# Altium schematic sheet ADC.SchDoc
size 420 x 297 mm; Author: Nguyễn Huy Hoàng; SheetNumber: 3; SheetTotal: 5; Instructor: Nguyễn Trung Hiếu
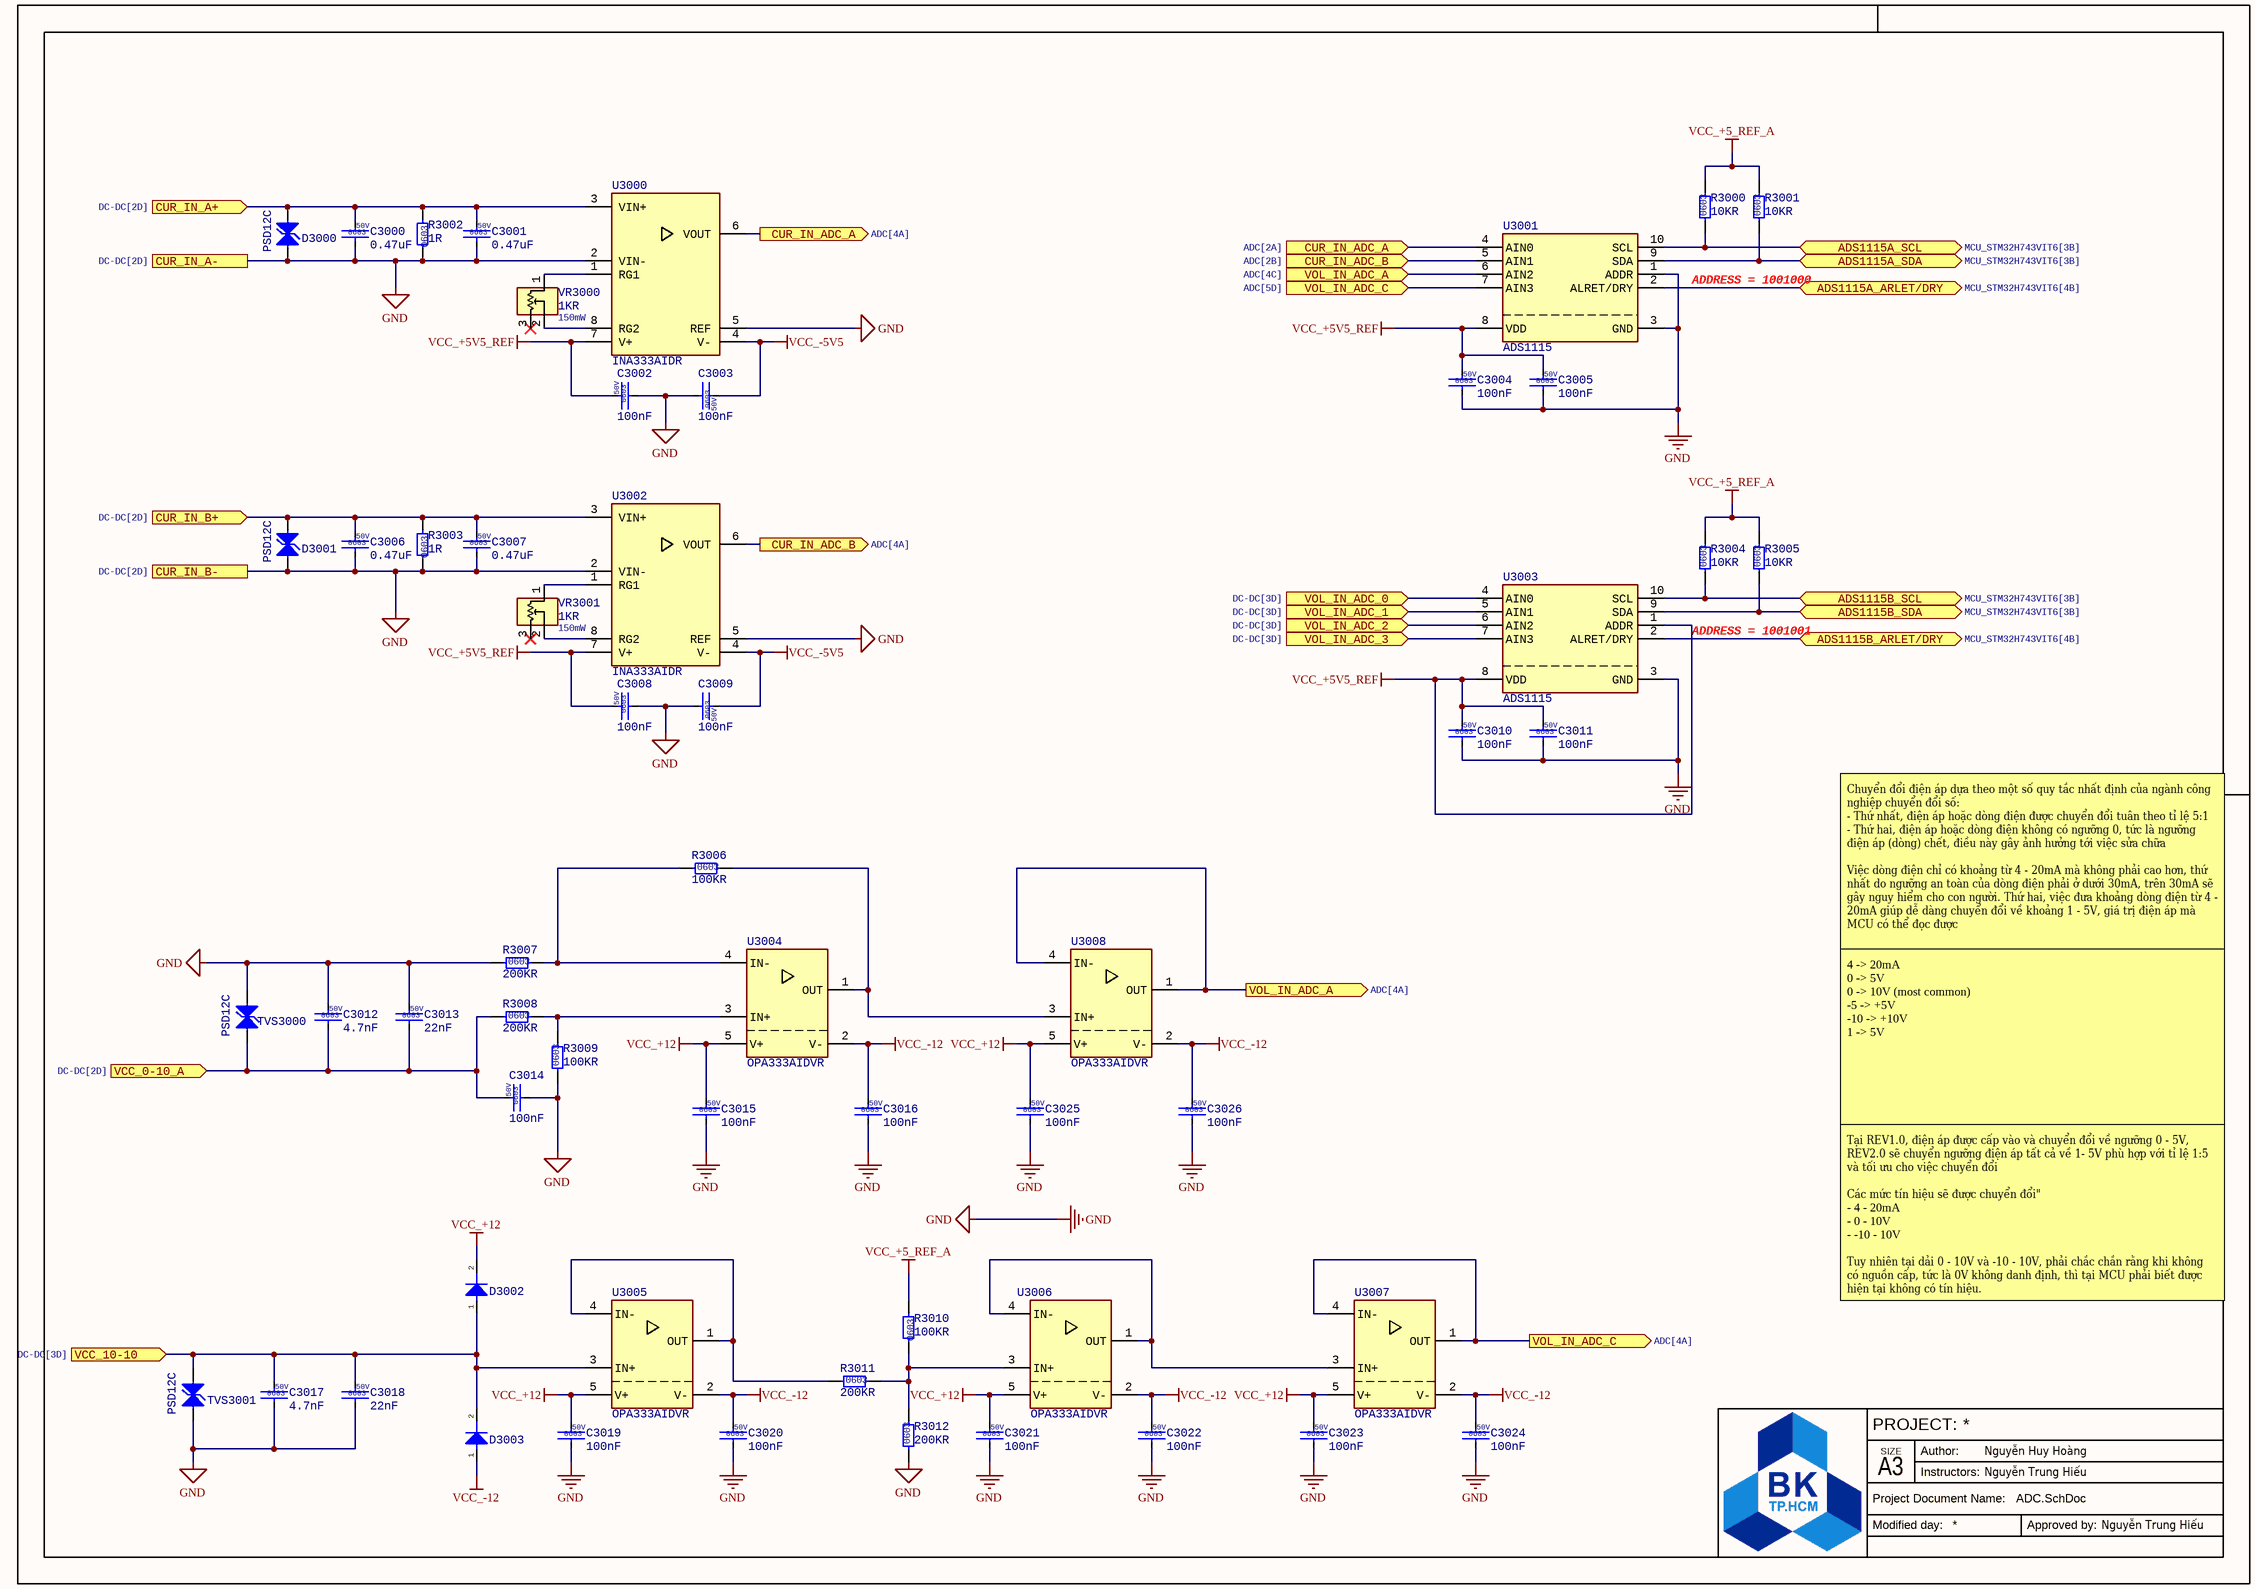
[diagram p0: ADC.SchDoc]

## Parts
C3000  0.47uF  Voltage: 50V  Size: 0603  [CAP CER 0603]
C3001  0.47uF  Voltage: 50V  Size: 0603  [CAP CER 0603]
C3002  100nF  Voltage: 50V  Size: 0603  [CAP CER 0603]
C3003  100nF  Voltage: 50V  Size: 0603  [CAP CER 0603]
C3004  100nF  Voltage: 50V  Size: 0603  [CAP CER 0603]
C3005  100nF  Voltage: 50V  Size: 0603  [CAP CER 0603]
C3006  0.47uF  Voltage: 50V  Size: 0603  [CAP CER 0603]
C3007  0.47uF  Voltage: 50V  Size: 0603  [CAP CER 0603]
C3008  100nF  Voltage: 50V  Size: 0603  [CAP CER 0603]
C3009  100nF  Voltage: 50V  Size: 0603  [CAP CER 0603]
C3010  100nF  Voltage: 50V  Size: 0603  [CAP CER 0603]
C3011  100nF  Voltage: 50V  Size: 0603  [CAP CER 0603]
C3012  4.7nF  Voltage: 50V  Size: 0603  [CAP CER 0603]
C3013  22nF  Voltage: 50V  Size: 0603  [CAP CER 0603]
C3014  100nF  Voltage: 50V  Size: 0603  [CAP CER 0603]
C3015  100nF  Voltage: 50V  Size: 0603  [CAP CER 0603]
C3016  100nF  Voltage: 50V  Size: 0603  [CAP CER 0603]
C3017  4.7nF  Voltage: 50V  Size: 0603  [CAP CER 0603]
C3018  22nF  Voltage: 50V  Size: 0603  [CAP CER 0603]
C3019  100nF  Voltage: 50V  Size: 0603  [CAP CER 0603]
C3020  100nF  Voltage: 50V  Size: 0603  [CAP CER 0603]
C3021  100nF  Voltage: 50V  Size: 0603  [CAP CER 0603]
C3022  100nF  Voltage: 50V  Size: 0603  [CAP CER 0603]
C3023  100nF  Voltage: 50V  Size: 0603  [CAP CER 0603]
C3024  100nF  Voltage: 50V  Size: 0603  [CAP CER 0603]
C3025  100nF  Voltage: 50V  Size: 0603  [CAP CER 0603]
C3026  100nF  Voltage: 50V  Size: 0603  [CAP CER 0603]
D3000  PSD12C  [SOD-323]
D3001  PSD12C  [SOD-323]
D3002  1N4148W-E3-18  [SOD-123]  (value not drawn)
D3003  1N4148W-E3-18  [SOD-123]  (value not drawn)
R3000  10KR  Size: 0603  [RESC 0603(1608) SMD]
R3001  10KR  Size: 0603  [RESC 0603(1608) SMD]
R3002  1R  Size: 0603  [RESC 0603(1608) SMD]
R3003  1R  Size: 0603  [RESC 0603(1608) SMD]
R3004  10KR  Size: 0603  [RESC 0603(1608) SMD]
R3005  10KR  Size: 0603  [RESC 0603(1608) SMD]
R3006  100KR  Size: 0603  [RESC 0603(1608) SMD]
R3007  200KR  Size: 0603  [RESC 0603(1608) SMD]
R3008  200KR  Size: 0603  [RESC 0603(1608) SMD]
R3009  100KR  Size: 0603  [RESC 0603(1608) SMD]
R3010  100KR  Size: 0603  [RESC 0603(1608) SMD]
R3011  200KR  Size: 0603  [RESC 0603(1608) SMD]
R3012  200KR  Size: 0603  [RESC 0603(1608) SMD]
TVS3000  PSD12C  [SOD-323]
TVS3001  PSD12C  [SOD-323]
U3000  INA333AIDR  [VSSOP-8]
U3001  ADS1115  [VSSOP-10]
U3002  INA333AIDR  [VSSOP-8]
U3003  ADS1115  [VSSOP-10]
U3004  OPA333AIDVR  [SOT23-5]
U3005  OPA333AIDVR  [SOT23-5]
U3006  OPA333AIDVR  [SOT23-5]
U3007  OPA333AIDVR  [SOT23-5]
U3008  OPA333AIDVR  [SOT23-5]
VR3000  1KR  Power Rate: 150mW  [VARIABLE RESISTOR]
VR3001  1KR  Power Rate: 150mW  [VARIABLE RESISTOR]

## Ports
ADS1115A_ARLET/DRY (bidir, see MCU_STM32H743VIT6[4B]), ADS1115A_SCL (bidir, see MCU_STM32H743VIT6[3B]), ADS1115A_SDA (bidir, see MCU_STM32H743VIT6[3B]), ADS1115B_ARLET/DRY (bidir, see MCU_STM32H743VIT6[4B]), ADS1115B_SCL (bidir, see MCU_STM32H743VIT6[3B]), ADS1115B_SDA (bidir, see MCU_STM32H743VIT6[3B]), CUR_IN_A+ (in, see DC-DC[2D]), CUR_IN_A- (see DC-DC[2D]), CUR_IN_ADC_A (in, see ADC[2A]), CUR_IN_ADC_A (out, see ADC[4A]), CUR_IN_ADC_B (in, see ADC[2B]), CUR_IN_ADC_B (out, see ADC[4A]), CUR_IN_B+ (in, see DC-DC[2D]), CUR_IN_B- (see DC-DC[2D]), VCC_0-10_A (in, see DC-DC[2D]), VCC_10-10 (in, see DC-DC[3D]), VOL_IN_ADC_0 (in, see DC-DC[3D]), VOL_IN_ADC_1 (in, see DC-DC[3D]), VOL_IN_ADC_2 (in, see DC-DC[3D]), VOL_IN_ADC_3 (in, see DC-DC[3D]), VOL_IN_ADC_A (in, see ADC[4C]), VOL_IN_ADC_A (out, see ADC[4A]), VOL_IN_ADC_C (in, see ADC[5D]), VOL_IN_ADC_C (out, see ADC[4A])

## Nets
GND: C3000.2 C3001.2 C3002.2 C3003.2 C3004.2 C3005.2 C3006.2 C3007.2 C3008.2 C3009.2 C3010.2 C3011.2 C3012.1 C3013.1 C3014.2 C3015.2 C3016.2 C3017.2 C3018.2 C3019.2 C3020.2 C3021.2 C3022.2 C3023.2 C3024.2 C3025.2 C3026.2 D3000.2 D3001.2 R3002.2 R3003.2 R3007.1 R3009.1 R3012.1 TVS3000.1 TVS3001.2 U3000.2(VIN-) U3000.5(REF) U3001.1(ADDR) U3001.3(GND) U3002.2(VIN-) U3002.5(REF) U3003.3(GND) ; port CUR_IN_A-, port CUR_IN_B-
VCC_+5_REF_A: R3000.2 R3001.2 R3004.2 R3005.2 R3010.1
VCC_+5V5_REF: C3002.1 C3004.1 C3005.1 C3008.1 C3010.1 C3011.1 U3000.7(V+) U3001.8(VDD) U3002.7(V+) U3003.1(ADDR) U3003.8(VDD)
VCC_+12: C3015.1 C3019.1 C3021.1 C3023.1 C3025.1 D3002.2(K) U3004.5(V+) U3005.5(V+) U3006.5(V+) U3007.5(V+) U3008.5(V+)
VCC_-5V5: C3003.1 C3009.1 U3000.4(V-) U3002.4(V-)
VCC_-12: C3016.1 C3020.1 C3022.1 C3024.1 C3026.1 D3003.1(A) U3004.2(V-) U3005.2(V-) U3006.2(V-) U3007.2(V-) U3008.2(V-)
ADS1115A_ARLET/DRY: U3001.2(ALRET/DRY) ; port ADS1115A_ARLET/DRY
ADS1115A_SCL: R3000.1 U3001.10(SCL) ; port ADS1115A_SCL
ADS1115A_SDA: R3001.1 U3001.9(SDA) ; port ADS1115A_SDA
ADS1115B_ARLET/DRY: U3003.2(ALRET/DRY) ; port ADS1115B_ARLET/DRY
ADS1115B_SCL: R3004.1 U3003.10(SCL) ; port ADS1115B_SCL
ADS1115B_SDA: R3005.1 U3003.9(SDA) ; port ADS1115B_SDA
CUR_IN_A+: C3000.1 C3001.1 D3000.1 R3002.1 U3000.3(VIN+) ; port CUR_IN_A+
CUR_IN_ADC_A: U3000.6(VOUT) U3001.4(AIN0) ; port CUR_IN_ADC_A
CUR_IN_ADC_B: U3001.5(AIN1) U3002.6(VOUT) ; port CUR_IN_ADC_B
CUR_IN_B+: C3006.1 C3007.1 D3001.1 R3003.1 U3002.3(VIN+) ; port CUR_IN_B+
VCC_0-10_A: C3012.2 C3013.2 C3014.1 R3008.1 TVS3000.2 ; port VCC_0-10_A
VCC_10-10: C3017.1 C3018.1 D3002.1(A) D3003.2(K) TVS3001.1 U3005.3(IN+) ; port VCC_10-10
VOL_IN_ADC_0: U3003.4(AIN0) ; port VOL_IN_ADC_0
VOL_IN_ADC_1: U3003.5(AIN1) ; port VOL_IN_ADC_1
VOL_IN_ADC_2: U3003.6(AIN2) ; port VOL_IN_ADC_2
VOL_IN_ADC_3: U3003.7(AIN3) ; port VOL_IN_ADC_3
VOL_IN_ADC_A: U3001.6(AIN2) U3008.1(OUT) U3008.4(IN-) ; port VOL_IN_ADC_A
VOL_IN_ADC_C: U3001.7(AIN3) U3007.1(OUT) U3007.4(IN-) ; port VOL_IN_ADC_C
NetR3006_1: R3006.1 R3007.2 U3004.4(IN-)
NetR3006_2: R3006.2 U3004.1(OUT) U3008.3(IN+)
NetR3008_2: R3008.2 R3009.2 U3004.3(IN+)
NetR3010_2: R3010.2 R3011.2 R3012.2 U3006.3(IN+)
NetR3011_1: R3011.1 U3005.1(OUT) U3005.4(IN-)
NetU3000_1: U3000.1(RG1) VR3000.1(a)
NetU3000_8: U3000.8(RG2) VR3000.2(b)
NetU3002_1: U3002.1(RG1) VR3001.1(a)
NetU3002_8: U3002.8(RG2) VR3001.2(b)
NetU3006_1: U3006.1(OUT) U3006.4(IN-) U3007.3(IN+)

Not connected (* = marked no-connect by the designer): VR3000 3(c)*; VR3001 3(c)*

## Notes on the sheet
- ADDRESS = 1001000
- ADDRESS = 1001001
- Chuyển đổi điện áp dựa theo một số quy tắc nhất định của ngành công nghiệp chuyển đổi số:
  - Thứ nhất, điện áp hoặc dòng điện được chuyển đổi tuân theo tỉ lệ 5:1
  - Thứ hai, điện áp hoặc dòng điện không có ngưỡng 0, tức là ngưỡng điện áp (dòng) chết, điều này gây ảnh hưởng tới việc sửa chữa
  Việc dòng điện chỉ có khoảng từ 4 - 20mA mà không phải cao hơn, thứ nhất do ngưỡng an toàn của dòng điện phải ở dưới 30mA, trên 30mA sẽ gây nguy hiểm cho con người. Thứ hai, việc đưa khoảng dòng điện từ 4 - 20mA giúp dễ dàng chuyển đổi về khoảng 1 - 5V, giá trị điện áp mà MCU có thể đọc được
- 4 -> 20mA
  0 -> 5V
  0 -> 10V (most common)
  -5 -> +5V
  -10 -> +10V
  1 -> 5V
- Tại REV1.0, điện áp được cấp vào và chuyển đổi về ngưỡng 0 - 5V, REV2.0 sẽ chuyển ngưỡng điện áp tất cả về 1- 5V phù hợp với tỉ lệ 1:5 và tối ưu cho việc chuyển đổi
  Các mức tín hiệu sẽ được chuyển đổi"
  - 4 - 20mA
  - 0 - 10V
  - -10 - 10V
  Tuy nhiên tại dải 0 - 10V và -10 - 10V, phải chắc chắn rằng khi không có nguồn cấp, tức là 0V không danh định, thì tại MCU phải biết được hiện tại không có tín hiệu.
- PROJECT:
- SIZE
- Author:
- Instructors:
- Project Document Name:
- Modified day:
- A3
- Approved by:

## Library data of the parts
C3000 C3001 C3006 C3007 = FF-1003: CAP CER SMD 0.47uF 10% 50V 0603; Type: CAP CER; Design Item ID: FF-1003; TH/SMD: SMD; Value: 0.47uF; Tolerance: 10%; Power Rate: N/A; Supplier: THEGIOIIC; Supplier Part Number: 10%, 0603 (1608 Metric); Supplier Link: https://www.thegioiic.com/tu-gom-0603-470nf-50v
C3002-C3005 C3008-C3011 C3014-C3016 C3019-C3026 = FF-1008: CAP CER SMD 100nF 10% 50V 0603; Type: CAP CER; Design Item ID: FF-1008; TH/SMD: SMD; Value: 100nF; Tolerance: 10%; Power Rate: N/A; Supplier: THEGIOIIC; Supplier Part Number: 10%, 0603 (1608 Metric); Supplier Link: https://www.thegioiic.com/tu-gom-0603-100nf-0-1uf-50v
C3012 C3017 = FF-1030: CAP CER SMD 4.7nF 10% 50V 0603; Type: CAP CER; Design Item ID: FF-1030; TH/SMD: SMD; Value: 4.7nF; Tolerance: 10%; Power Rate: N/A; Supplier: THEGIOIIC; Supplier Part Number: 10%, 0603 (1608 Metric); Supplier Link: https://www.thegioiic.com/tu-gom-0603-4-7nf-50v
C3013 C3018 = FF-1031: CAP CER SMD 22nF 10% 50V 0603; Type: CAP CER; Design Item ID: FF-1031; TH/SMD: SMD; Value: 22nF; Tolerance: 10%; Power Rate: N/A; Supplier: THEGIOIIC; Supplier Part Number: 10%, 0603 (1608 Metric); Supplier Link: https://www.thegioiic.com/tu-gom-0603-22nf-50v
D3000 D3001 TVS3000 TVS3001 = FF-4015: Package SOD323, Diode TVS, 50pF, 29.5V; TH/SMD: SMD; Design Item ID: FF-4015; Type: TVS DIODE; Value: 50 pF, 29.5V; Tolerance: N/A; Voltage: 29.5V; Power Rate: N/A; Size: SOD-323; Supplier: THEGIOIIC; Supplier Part Number: PSD12C; Supplier Link: https://www.thegioiic.com/psd12c
D3002 D3003 = FF-4016: Diode Standard 75V 150mA; TH/SMD: SMD; Design Item ID: FF-4016; Type: DIODE; Value: 75V 150mA; Tolerance: N/A; Voltage: 75V; Power Rate: N/A; Size: SOD-123; Supplier: THEGIOIIC; Supplier Part Number: 1N4148W-E3-18; Supplier Link: https://www.thegioiic.com/1n4148w-e3-18-diode-gen-purp-75v-150ma-sod123
R3000 R3001 R3004 R3005 = FF-0020: RESISTOR SMD 10KR OHM 1% 100mW 0603; Power Rate: 100mW; Design Item ID: FF-0020; Type: RESISTOR; TH/SMD: SMD; Value: 10KR; Tolerance: 1%; Voltage: N/A; Supplier: THEGIOIIC; Supplier Part Number: 103, 1/10W; Supplier Link: https://www.thegioiic.com/dien-tro-10-kohm-0603-1-
R3002 R3003 = FF-0011: RESISTOR SMD 1R OHM 1% 100mW 0603; Power Rate: 100mW; Design Item ID: FF-0011; Type: RESISTOR; TH/SMD: SMD; Value: 1R; Tolerance: 1%; Voltage: N/A; Supplier: THEGIOIIC; Supplier Part Number: 1R0, 1/10W; Supplier Link: https://www.thegioiic.com/dien-tro-1-ohm-0603-1-
R3006 R3009 R3010 = FF-0029: RESISTOR SMD 100KR OHM 1% 100mW 0603; Type: RESISTOR; TH/SMD: SMD; Value: 100KR; Tolerance: 1%; Voltage: N/A; Power Rate: 100mW; Supplier: THEGIOIIC; Supplier Part Number: 104, 1/10W; Supplier Link: https://www.thegioiic.com/dien-tro-100-kohm-0603-1-; Design Item ID: FF-0029
R3007 R3008 R3011 R3012 = FF-0036: RESISTOR SMD 200KR OHM 1% 100mW 0603; Type: RESISTOR; TH/SMD: SMD; Value: 200KR; Tolerance: 1%; Voltage: N/A; Power Rate: 100mW; Supplier: THEGIOIIC; Supplier Part Number: 2003, 1/10W; Supplier Link: https://www.thegioiic.com/dien-tro-200-kohm-0603-1-; Design Item ID: FF-0036
U3000 U3002 = FF-2005: INA333 Micro-Power (50μA), Zerø-Drift, Rail-to-Rail Out Instrumentation Amplifier; TH/SMD: SMD; Design Item ID: FF-2005; Type: IC; Value: INA333AIDR; Tolerance: N/A; Voltage: N/A; Power Rate: N/A; Size: VSSOP-8; Supplier: SELF
U3001 U3003 = FF-2002: ADS111x Ultra-Small, Low-Power, I2C-Compatible, 860-SPS, 16-Bit ADCs With Internal Reference, Oscillator, and Programmable Comparator; TH/SMD: SMD; Value: ADS1115; Design Item ID: FF-2002; Type: IC; Tolerance: N/A; Voltage: N/A; Power Rate: N/A; Size: VSSOP-10; Supplier: SELF
U3004-U3008 = FF-2010: OPAx333 1.8-V, microPower, CMOS Operational Amplifiers, Zero-Drift Series; TH/SMD: SMD; Design Item ID: FF-2010; Type: IC; Value: OPA333AIDVR; Tolerance: N/A; Voltage: N/A; Power Rate: N/A; Size: SOT23-5; Supplier: SELF; Supplier Link: https://shopee.vn/(10-C%C3%A1i)-Chip-100-Opa333Aidvr-OPA333-Oxq-sot23-5-M%E1%BB%9Bi-i.1003955517.21782141850?sp_atk=4701d033-6a8f-4bdf-a833-fbc55ec2f47d&xptdk=4701d033-6a8f-4bdf-a833-fbc55ec2f47d
VR3000 VR3001 = FF-0048: VARIABLE RESISTOR SMD 1KR OHM 20% 150mW N/A; Design Item ID: FF-0048; Size: N/A; Type: VARIABLE RESISTOR; TH/SMD: SMD; Value: 1KR; Tolerance: 20%; Voltage: N/A; Supplier: N/A; Supplier Part Number: 1K Ohm, 20%; Supplier Link: https://www.thegioiic.com/evm3e-102-bien-tro-1-kohm-nut-ao-smd-0-15w